# Altium schematic sheet Display.SchDoc
size A4; SheetNumber: 4; SheetTotal: 7
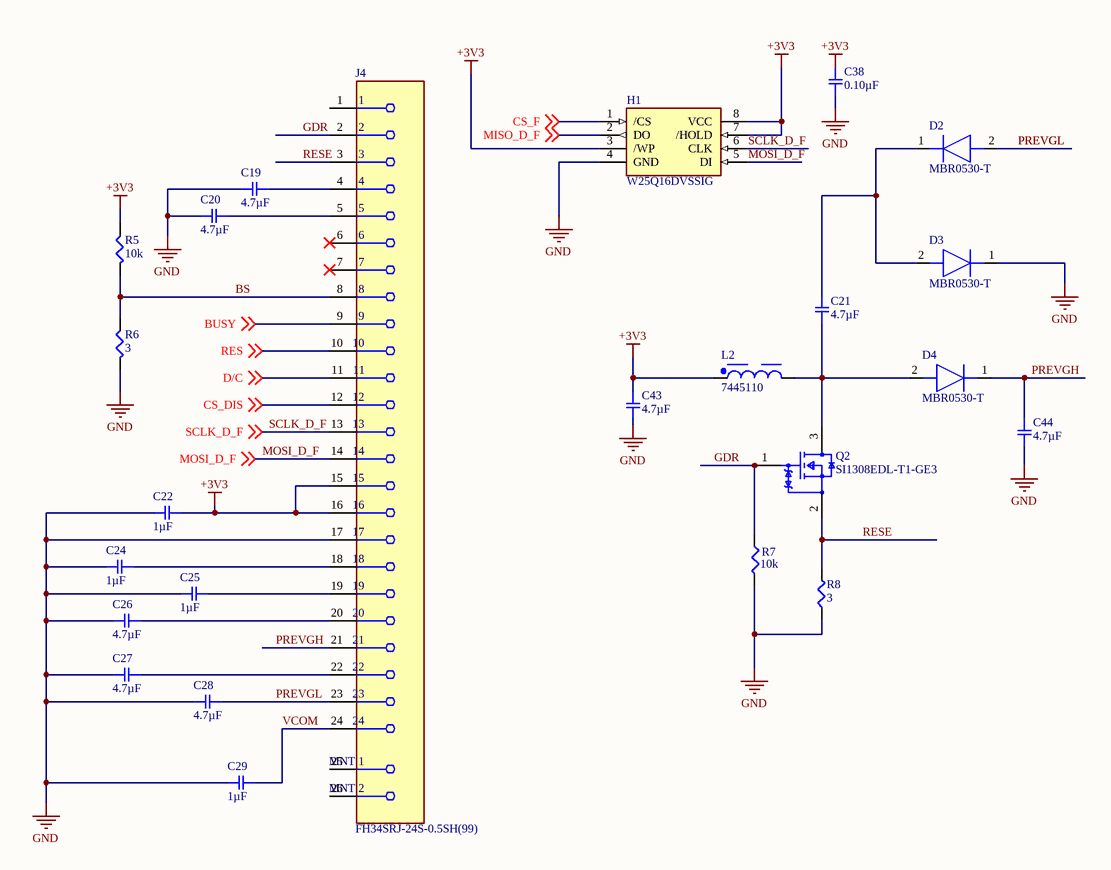
[diagram p0: Display.SchDoc]

## Parts
C19  4.7µF  [SMD-0402C]
C20  4.7µF  [SMD-0402C]
C21  4.7µF  [SMD-0402C]
C22  1µF  [SMD-0402C]
C24  1µF  [SMD-0402C]
C25  1µF  [SMD-0402C]
C26  4.7µF  [SMD-0402C]
C27  4.7µF  [SMD-0402C]
C28  4.7µF  [SMD-0402C]
C29  1µF  [SMD-0402C]
C38  0.10µF  [SMD-0402C]
C43  4.7µF  [SMD-0402C]
C44  4.7µF  [SMD-0402C]
D2  MBR0530-T  [SOD3716X135N]
D3  MBR0530-T  [SOD3716X135N]
D4  MBR0530-T  [SOD3716X135N]
H1  W25Q16DVSSIG  [SOIC127P790X216-8N]
J4  FH34SRJ-24S-0.5SH(99)  [FP-FH34SRJ-24S-0_5SH_99-MFG]
L2  7445110  [WE-PD3_Type S]
Q2  SI1308EDL-T1-GE3  [FP-5549-MFG]
R5  10k  [SMD-0402-RES]
R6  3  [SMD-0402-RES]
R7  10k  [SMD-0402-RES]
R8  3  [SMD-0402-RES]

## Nets
+3V3: C22.1 C38.1 C43.1 H1.3(/WP) H1.7(/HOLD) H1.8(VCC) J4.15 J4.16 L2.1 R5.1
GND: C19.2 C20.2 C22.2 C24.2 C25.2 C26.2 C27.2 C28.2 C29.2 C38.2 C43.2 C44.2 D3.1(K) H1.4(GND) J4.17 R6.2 R7.2 R8.1
BS: J4.8 R5.2 R6.1
BUSY: J4.9 ; off-sheet BUSY
CS_DIS: J4.12 ; off-sheet CS_DIS
CS_F: H1.1(/CS) ; off-sheet CS_F
D/C: J4.11 ; off-sheet D/C
GDR: J4.2 Q2.1(G) R7.1
MISO_D_F: H1.2(DO) ; off-sheet MISO_D_F
MOSI_D_F: H1.5(DI) J4.14 ; off-sheet MOSI_D_F
PREVGH: C44.1 D4.1(K) J4.21
PREVGL: C28.1 D2.2(A) J4.23
RES: J4.10 ; off-sheet RES
RESE: J4.3 Q2.2(S) R8.2
SCLK_D_F: H1.6(CLK) J4.13 ; off-sheet SCLK_D_F
VCOM: C29.1 J4.24
NetC19_1: C19.1 J4.4
NetC20_1: C20.1 J4.5
NetC21_1: C21.1 D4.2(A) L2.2 Q2.3(D)
NetC21_2: C21.2 D2.1(K) D3.2(A)
NetC24_1: C24.1 J4.18
NetC25_1: C25.1 J4.19
NetC26_1: C26.1 J4.20
NetC27_1: C27.1 J4.22

Not connected (* = marked no-connect by the designer): J4 1 6* 7* 25(MNT_1) 26(MNT_2)

## Library data of the parts
C19-C21 C26-C28 = ZRB15XR61A475ME01D: CAP CER 4.7UF 10V X5R 0402; Manufacturer: Murata Electronics North America; Factory Stock: 0; Unit Price (USD): 0.36; Minimum Quantity: 1; Tolerance: ±20%; Datasheets: http://search.murata.co.jp/Ceramy/image/img/A01X/G101/ENG/ZRB15XR61A475ME01-01.pdf; Image: //media.digikey.com/Renders/Murata%20Renders/ZRB-SERIES-0402.jpg; Digi-Key Part Number: 490-10984-1-ND; Part Number: ZRB15XR61A475ME01D; Quantity Available: 53897; @ qty: 0; Packaging: Cut Tape (CT); Series: ZRB; Part Status: Active; Value: 4.7µF; Voltage: 10V; Temperature Coefficient: X5R; Operating Temperature: -55°C ~ 85°C; Features: Derating Recommended, Interposer Termination; Ratings: -; Applications: Acoustic Noise Reduction; Mounting Type: Surface Mount, MLCC; Package / Case: 0402 (1005 Metric); Size / Dimension: 0.039" L x 0.020" W (1.00mm x 0.50mm); Height - Seated (Max): -; Thickness (Max): 0.031" (0.80mm); Lead Spacing: -; Lead Style: -
C22 C24 C25 C29 = GRM155R61E105MA12D: CAP CER 1UF 25V X5R 0402; Manufacturer: Murata Electronics North America; Factory Stock: 0; Unit Price (USD): 0.1; Minimum Quantity: 1; Tolerance: ±20%; Datasheets: http://www.murata.com/~/media/webrenewal/support/library/catalog/products/capacitor/mlcc/c02e.pdf; Image: //media.digikey.com/Renders/Murata%20Renders/ZRB-SERIES-0402.jpg; Digi-Key Part Number: 490-10018-1-ND; Part Number: GRM155R61E105MA12D; Quantity Available: 32609; @ qty: 0; Packaging: Cut Tape (CT); Series: GRM; Part Status: Active; Value: 1µF; Voltage: 25V; Temperature Coefficient: X5R; Operating Temperature: -55°C ~ 85°C; Features: Derating Recommended; Ratings: -; Applications: General Purpose; Mounting Type: Surface Mount, MLCC; Package / Case: 0402 (1005 Metric); Size / Dimension: 0.039" L x 0.020" W (1.00mm x 0.50mm); Height - Seated (Max): -; Thickness (Max): 0.022" (0.55mm); Lead Spacing: -; Lead Style: -
C38 = GCM155R71C104KA55D: CAP CER 0.1UF 16V X7R 0402; Manufacturer: Murata Electronics North America; Factory Stock: 0; Unit Price (USD): 0.1; Minimum Quantity: 1; Tolerance: ±10%; Datasheets: http://www.murata.com/~/media/webrenewal/support/library/catalog/products/capacitor/mlcc/c03e.ashx; Image: //media.digikey.com/Renders/Murata%20Renders/ZRB-SERIES-0402.jpg; Digi-Key Part Number: 490-4759-1-ND; Part Number: GCM155R71C104KA55D; Quantity Available: 734194; @ qty: 0; Packaging: Cut Tape (CT); Series: GCM; Part Status: Active; Value: 0.10µF; Voltage: 16V; Temperature Coefficient: X7R; Operating Temperature: -55°C ~ 125°C; Features: -; Ratings: AEC-Q200; Applications: Automotive; Mounting Type: Surface Mount, MLCC; Package / Case: 0402 (1005 Metric); Size / Dimension: 0.039" L x 0.020" W (1.00mm x 0.50mm); Height - Seated (Max): -; Thickness (Max): 0.022" (0.55mm); Lead Spacing: -; Lead Style: -
C43 C44 = ZRB15XR61A475KE01D: CAP CER 4.7UF 10V X5R 0402; Manufacturer: Murata Electronics North America; Factory Stock: 0; Unit Price (USD): 0.28; Minimum Quantity: 1; Tolerance: ±10%; Datasheets: http://search.murata.co.jp/Ceramy/image/img/A01X/G101/ENG/ZRB15XR61A475KE01-01.pdf; Image: //media.digikey.com/Renders/Murata%20Renders/ZRB-SERIES-0402.jpg; Digi-Key Part Number: 490-13252-1-ND; Part Number: ZRB15XR61A475KE01D; Quantity Available: 23076; @ qty: 0; Packaging: Cut Tape (CT); Series: ZRB; Part Status: Active; Value: 4.7µF; Voltage: 10V; Temperature Coefficient: X5R; Operating Temperature: -55°C ~ 85°C; Features: Derating Recommended, Interposer Termination; Ratings: -; Applications: Acoustic Noise Reduction; Mounting Type: Surface Mount, MLCC; Package / Case: 0402 (1005 Metric); Size / Dimension: 0.039" L x 0.020" W (1.00mm x 0.50mm); Height - Seated (Max): -; Thickness (Max): 0.031" (0.80mm); Lead Spacing: -; Lead Style: -
D2-D4 = MBR0530-T: Diode; Manufacturer_Name: MCC; Datasheet Link: https://componentsearchengine.com/Datasheets/1/MBR0530-T.pdf; Height: 1.35mm; Manufacturer_Part_Number: MBR0530-T; Mouser Part Number: 833-MBR0530-T; Mouser Price/Stock: https://www.mouser.co.uk/ProductDetail/Micro-Commercial-Components-MCC/MBR0530-T?qs=9VyI4qLX4NTSXkb9ynzJnA%3D%3D
H1 = W25Q16DVSSIG: Hardware; Manufacturer_Name: Winbond; Datasheet Link: https://www.winbond.com/resource-files/da00-w25q16dv_f2.pdf; Height: 2.16mm; Manufacturer_Part_Number: W25Q16DVSSIG; Mouser Part Number: N/A; Mouser Price/Stock: https://www.mouser.co.uk/ProductDetail/Winbond/W25Q16DVSSIG?qs=rkhjVJ6%2F3EKYKn%2FdfCfLNQ%3D%3D
J4 = CMP-11609-000022-1: CONN FPC/FFC 24POS .5MM; Number of Positions: 24; Actuator Material: Nylon; Voltage Rating: 50V; Pitch: 0.02inch; Current Rating: 500mA; Contact Plating: Gold; Packaging: Tape and Reel; RoHS Compliant: Yes; Contact Material: Bronze; Min Operating Temperature: -55°C; Max Operating Temperature: 85°C; Number of Pins: 24; Housing Material: Polymer; Termination: Solder; Mount: Surface Mount; Flammability Rating: UL94 V-0
L2 = CMP-0227-00829-2: NexarPartId: 8917249; Self Resonant Frequency: 30MHz; Inductance: 10µH; Max DC Current: 1A; Saturation Current: 450mA; Resistance: 56mΩ; Test Frequency: 100kHz; Core Material: Ferrite; Inductance Tolerance: 20%; Shielding: Shielded; Max Operating Temperature: 125°C; RoHS: Compliant; Height - Seated (Max): 2.9972mm; Min Operating Temperature: -40°C; Height: 2.92mm; Length: 6.6mm; Width: 4.45mm; Mount: Surface Mount; Case/Package: Nonstandard; REACH SVHC: Unknown; Composition: Wirewound; Ambient Temperature Range Low: -40°C; Lead Free: Lead Free; DC Resistance (DCR): 56mΩ; Current Rating: 1A; Number of Pins: 2; Tolerance: 20%; RMS Current (Irms): 1A; Ambient Temperature Range High: 85°C; Packaging: Cut Tape (CT); Depth: 4.45mm
Q2 = CMP-02550-000099-2: MOSFET N-CH 30V 1.4A SC-70-3; Fall Time: 8ns; Max Power Dissipation: 500mW; Rise Time: 9ns; Rds On Max: 132mR; Power Dissipation: 400mW; Polarity: N-CHANNEL; Number of Elements: 1; Element Configuration: Single; Threshold Voltage: 600mV; Continuous Drain Current (ID): 1.5A; Gate to Source Voltage (Vgs): 12V; Turn-On Delay Time: 2ns; Input Capacitance: 105pF; Package Quantity: 3000; REACH SVHC: No SVHC; Mount: Surface Mount; Packaging: Tape and Reel; On-State Resistance: 132mR; Drain-source On Resistance-Max: 132mR; Lead Free: Lead Free; Drain to Source Breakdown Voltage: 30V; Series: TrenchFET®; Max Operating Temperature: 150°C; Drain to Source Resistance: 132mR; Radiation Hardening: No; Length: 2.2mm; Min Operating Temperature: -55°C; Number of Channels: 1; Drain to Source Voltage (Vdss): 30V; Number of Pins: 3; Turn-Off Delay Time: 8ns; Weight: 0.004395oz; RoHS Compliant: Yes; Width: 1.35mm; Height: 1mm; Case/Package: SOT-323
R5 R7 = ERJ-2GEJ103X: RES SMD 10K OHM 5% 1/10W 0402; Manufacturer: Panasonic Electronic Components; Factory Stock: 0; Unit Price (USD): 0.00350; @ qty: 1500; Minimum Quantity: 1; Power (Watts): 0.1W, 1/10W; Temperature Coefficient: ±200ppm/°C; Part Number: ERJ-2GEJ103X; Datasheets: http://industrial.panasonic.com/www-cgi/jvcr13pz.cgi?E+PZ+3+AOA0001+ERJ2GEJ103X+7+WW; Image: //media.digikey.com/Photos/Panasonic%20Photos/ERJ-PA2-Series.jpg; Digi-Key Part Number: P10KJCT-ND; Quantity Available: 2560215; Packaging: Cut Tape (CT); Series: ERJ; Part Status: Active; Value: 10k; Tolerance: ±5%; Composition: Thick Film; Features: Automotive AEC-Q200; Operating Temperature: -55°C ~ 155°C; Package / Case: 0402 (1005 Metric); Supplier Device Package: 0402; Size / Dimension: 0.039" L x 0.020" W (1.00mm x 0.50mm); Height - Seated (Max): 0.016" (0.40mm); Number of Terminations: 2; Failure Rate: -
R6 R8 = ERJ-2GEJ3R0X: RES SMD 3 OHM 5% 1/10W 0402; Manufacturer: Panasonic Electronic Components; Factory Stock: 0; Unit Price (USD): 0.00350; @ qty: 1500; Minimum Quantity: 1; Power (Watts): 0.1W, 1/10W; Temperature Coefficient: -100/ +600ppm/°C; Part Number: ERJ-2GEJ3R0X; Datasheets: http://industrial.panasonic.com/www-cgi/jvcr13pz.cgi?E+PZ+3+AOA0001+ERJ2GEJ3R0X+7+WW; Image: //media.digikey.com/Photos/Panasonic%20Photos/ERJ-PA2-Series.jpg; Digi-Key Part Number: P3.0JCT-ND; Quantity Available: 212144; Packaging: Cut Tape (CT); Series: ERJ; Part Status: Active; Value: 3; Tolerance: ±5%; Composition: Thick Film; Features: Automotive AEC-Q200; Operating Temperature: -55°C ~ 155°C; Package / Case: 0402 (1005 Metric); Supplier Device Package: 0402; Size / Dimension: 0.039" L x 0.020" W (1.00mm x 0.50mm); Height - Seated (Max): 0.016" (0.40mm); Number of Terminations: 2; Failure Rate: -